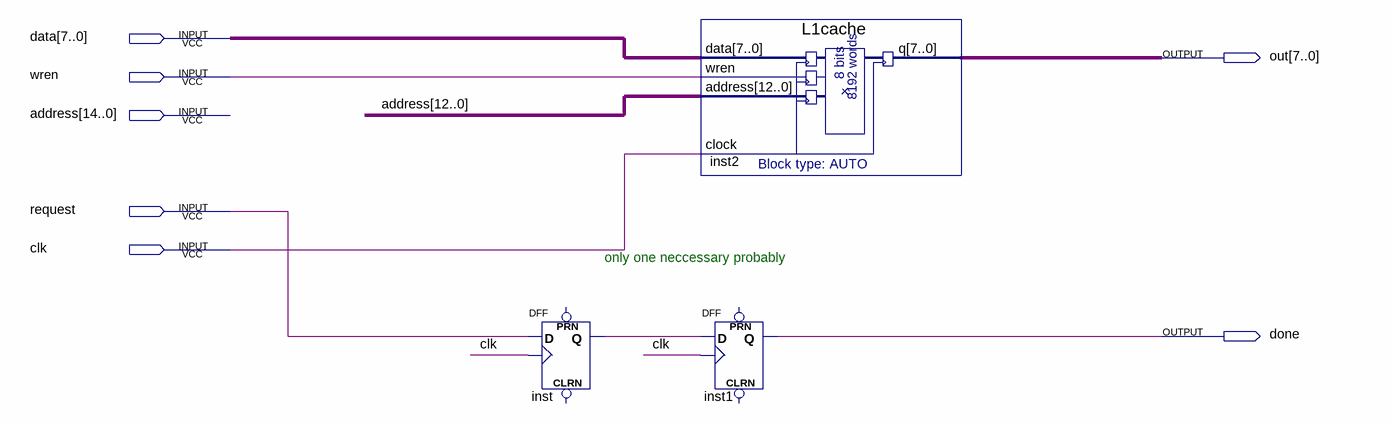
[diagram p0: schematic sheet]
// Quartus schematic CacheMemmory.bdf as structural Verilog: 3 symbols, 7 pins
module CacheMemmory (
  input  [7:0] data,
  input  wren,
  input  [14:0] address,
  input  request,
  input  clk,
  output [7:0] out,
  output done
);

  wire inst_q;

  DFF inst (.CLK(clk), .D(request), .Q(inst_q));  // open: CLRN, PRN
  L1cache inst2 (.data(data), .wren(wren), .address(address[12:0]), .clock(clk), .q(out));
  DFF inst1 (.CLK(clk), .D(inst_q), .Q(done));  // open: CLRN, PRN

  // Notes on the sheet:
  //   only one neccessary probably
endmodule
